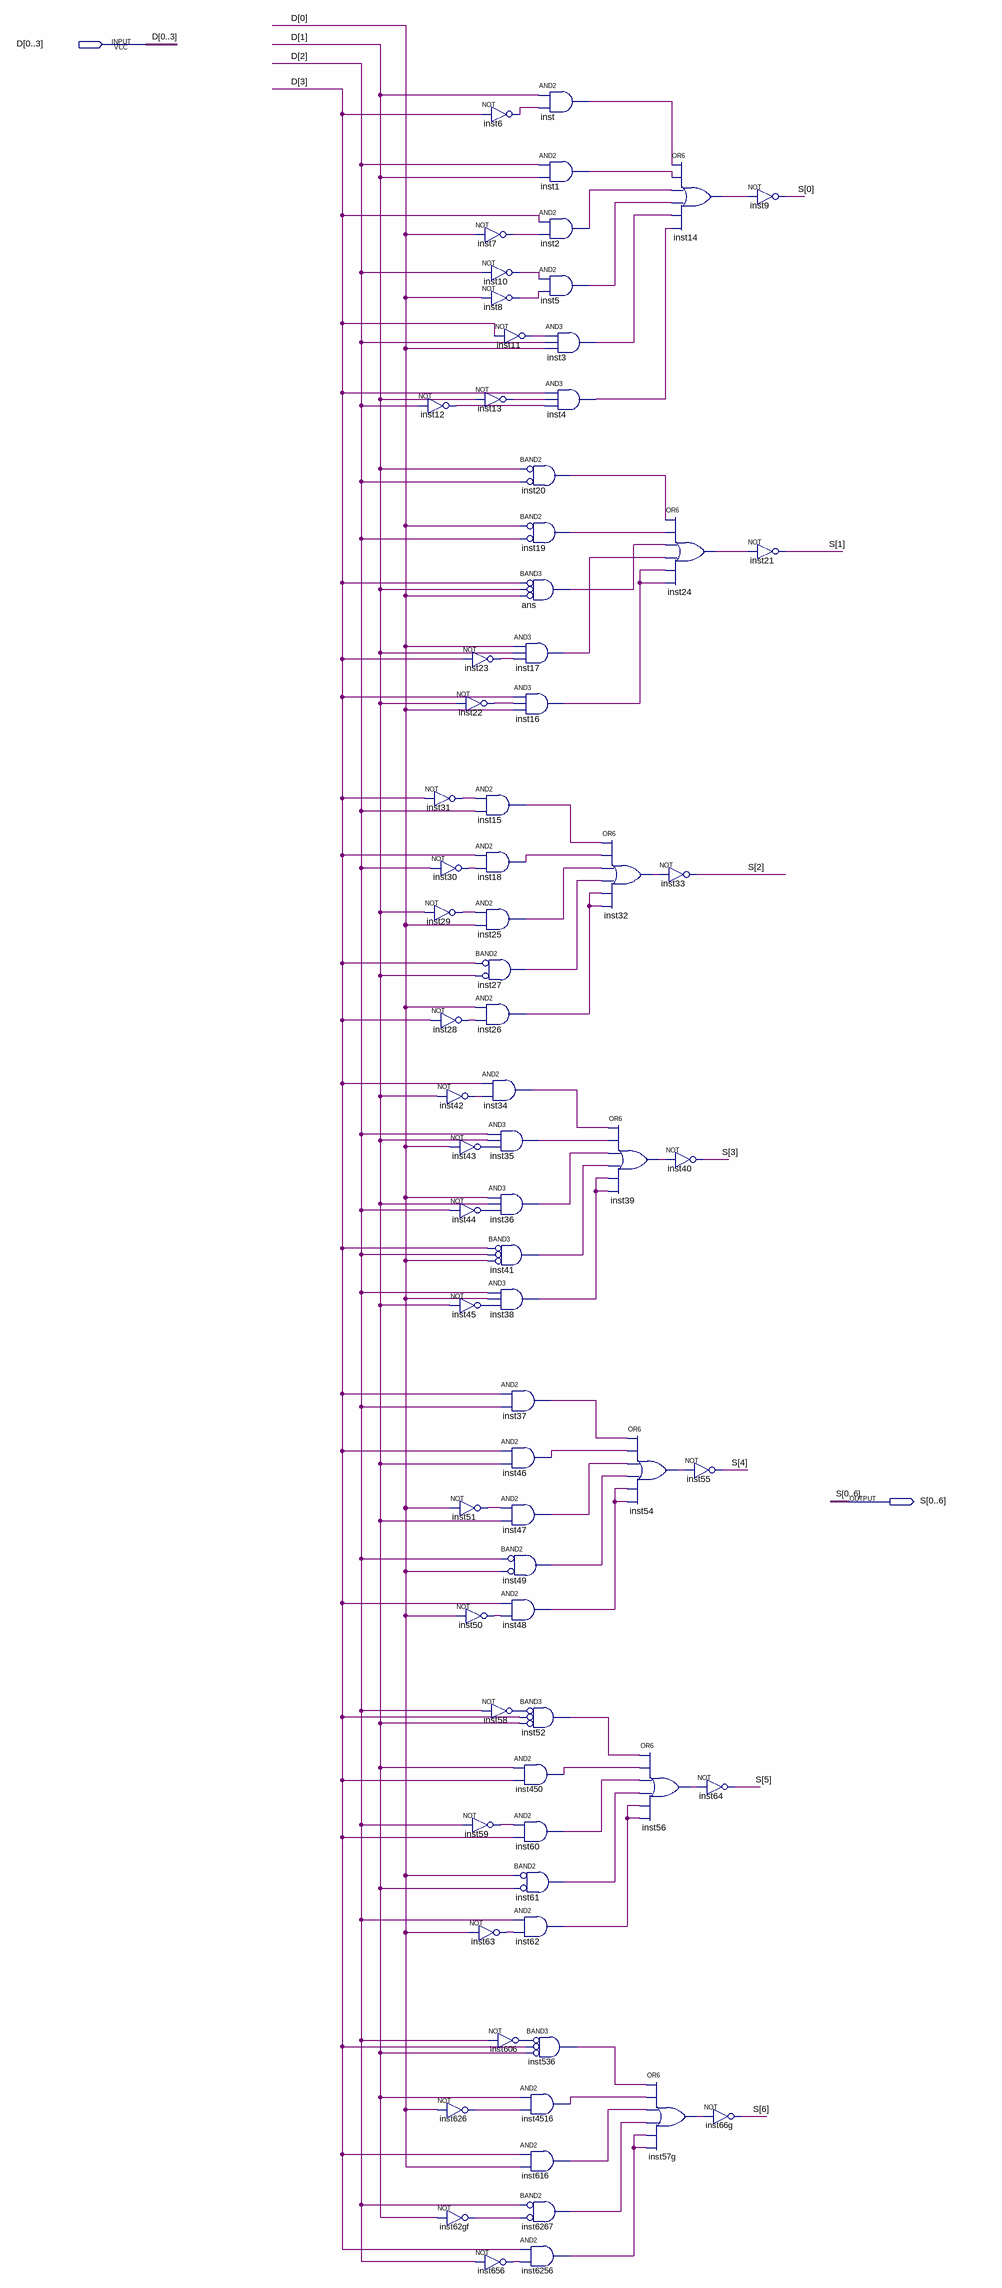
[diagram p0: schematic sheet]
// Quartus schematic 7_seg_disp.bdf as structural Verilog: 76 symbols, 2 pins
module \7_seg_disp  (
  input  [0:3] D,
  output [0:6] S
);

  wire ans_out, inst1_out, inst2_out, inst3_out, inst4_out, inst5_out, inst6_out, inst7_out, inst8_out,
       inst10_out, inst11_out, inst12_out, inst13_out, inst14_out, inst15_out, inst16_out, inst17_out,
       inst18_out, inst19_out, inst20_out, inst22_out, inst23_out, inst24_out, inst25_out, inst26_out,
       inst27_out, inst28_out, inst29_out, inst30_out, inst31_out, inst32_out, inst34_out, inst35_out,
       inst36_out, inst37_out, inst38_out, inst39_out, inst41_out, inst42_out, inst43_out, inst44_out,
       inst45_out, inst46_out, inst47_out, inst48_out, inst49_out, inst50_out, inst51_out, inst52_out,
       inst54_out, inst56_out, inst57g_out, inst58_out, inst59_out, inst60_out, inst61_out, inst62_out,
       inst62gf_out, inst63_out, inst450_out, inst536_out, inst606_out, inst616_out, inst626_out,
       inst656_out, inst4516_out, inst6256_out, inst6267_out, inst_out;

  not inst12 (inst12_out, D[2]);
  not inst23 (inst23_out, D[3]);
  not inst22 (inst22_out, D[1]);
  not inst31 (inst31_out, D[3]);
  not inst30 (inst30_out, D[2]);
  not inst29 (inst29_out, D[1]);
  not inst28 (inst28_out, D[3]);
  not inst42 (inst42_out, D[1]);
  not inst43 (inst43_out, D[0]);
  not inst44 (inst44_out, D[2]);
  not inst45 (inst45_out, D[1]);
  not inst51 (inst51_out, D[0]);
  not inst50 (inst50_out, D[0]);
  not inst59 (inst59_out, D[2]);
  not inst626 (inst626_out, D[0]);
  not inst62gf (inst62gf_out, D[1]);
  not inst6 (inst6_out, D[3]);
  not inst7 (inst7_out, D[0]);
  not inst10 (inst10_out, D[2]);
  not inst8 (inst8_out, D[0]);
  not inst11 (inst11_out, D[3]);
  not inst13 (inst13_out, D[1]);
  and inst17 (inst17_out, D[0], D[1], inst23_out);
  and inst16 (inst16_out, D[3], inst22_out, D[0]);
  and inst15 (inst15_out, inst31_out, D[2]);
  and inst18 (inst18_out, D[3], inst30_out);
  and inst25 (inst25_out, inst29_out, D[0]);
  and inst27 (inst27_out, ~D[3], ~D[1]);  // BAND2
  and inst26 (inst26_out, D[0], inst28_out);
  and inst34 (inst34_out, D[3], inst42_out);
  and inst35 (inst35_out, D[2], D[1], inst43_out);
  and inst36 (inst36_out, D[0], D[1], inst44_out);
  and inst41 (inst41_out, ~D[3], ~D[2], ~D[0]);  // BAND3
  and inst38 (inst38_out, D[2], D[0], inst45_out);
  and inst37 (inst37_out, D[3], D[2]);
  and inst46 (inst46_out, D[3], D[1]);
  and inst47 (inst47_out, inst51_out, D[1]);
  and inst49 (inst49_out, ~D[2], ~D[0]);  // BAND2
  and inst48 (inst48_out, D[3], inst50_out);
  not inst58 (inst58_out, D[2]);
  and inst450 (inst450_out, D[1], D[3]);
  and inst60 (inst60_out, inst59_out, D[3]);
  and inst61 (inst61_out, ~D[0], ~D[1]);  // BAND2
  and inst62 (inst62_out, D[2], inst63_out);
  not inst63 (inst63_out, D[0]);
  not inst606 (inst606_out, D[2]);
  not inst656 (inst656_out, D[2]);
  and inst (inst_out, D[1], inst6_out);
  and inst1 (inst1_out, D[2], D[1]);
  and inst2 (inst2_out, D[3], inst7_out);
  and inst5 (inst5_out, inst10_out, inst8_out);
  and inst3 (inst3_out, inst11_out, D[2], D[0]);
  and inst4 (inst4_out, D[3], inst13_out, inst12_out);
  and inst20 (inst20_out, ~D[1], ~D[2]);  // BAND2
  and inst19 (inst19_out, ~D[0], ~D[2]);  // BAND2
  and ans (ans_out, ~D[3], ~D[1], ~D[0]);  // BAND3
  and inst52 (inst52_out, ~inst58_out, ~D[3], ~D[1]);  // BAND3
  and inst536 (inst536_out, ~inst606_out, ~D[3], ~D[1]);  // BAND3
  and inst4516 (inst4516_out, D[1], inst626_out);
  and inst616 (inst616_out, D[3], D[0]);
  and inst6267 (inst6267_out, ~D[2], ~inst62gf_out);  // BAND2
  and inst6256 (inst6256_out, D[3], inst656_out);
  or inst32 (inst32_out, inst15_out, inst18_out, inst25_out, inst27_out, inst26_out, inst26_out);
  or inst39 (inst39_out, inst34_out, inst35_out, inst36_out, inst41_out, inst38_out, inst38_out);
  or inst24 (inst24_out, inst20_out, inst19_out, ans_out, inst17_out, inst16_out, inst16_out);
  not inst33 (S[2], inst32_out);
  not inst40 (S[3], inst39_out);
  or inst54 (inst54_out, inst37_out, inst46_out, inst47_out, inst49_out, inst48_out, inst48_out);
  or inst56 (inst56_out, inst52_out, inst450_out, inst60_out, inst61_out, inst62_out, inst62_out);
  or inst57g (inst57g_out, inst536_out, inst4516_out, inst616_out, inst6267_out, inst6256_out, inst6256_out);
  or inst14 (inst14_out, inst_out, inst1_out, inst2_out, inst5_out, inst3_out, inst4_out);
  not inst55 (S[4], inst54_out);
  not inst64 (S[5], inst56_out);
  not inst66g (S[6], inst57g_out);
  not inst9 (S[0], inst14_out);
  not inst21 (S[1], inst24_out);
endmodule
